# EAGLE design school_shield (EAGLE 9.6.2)
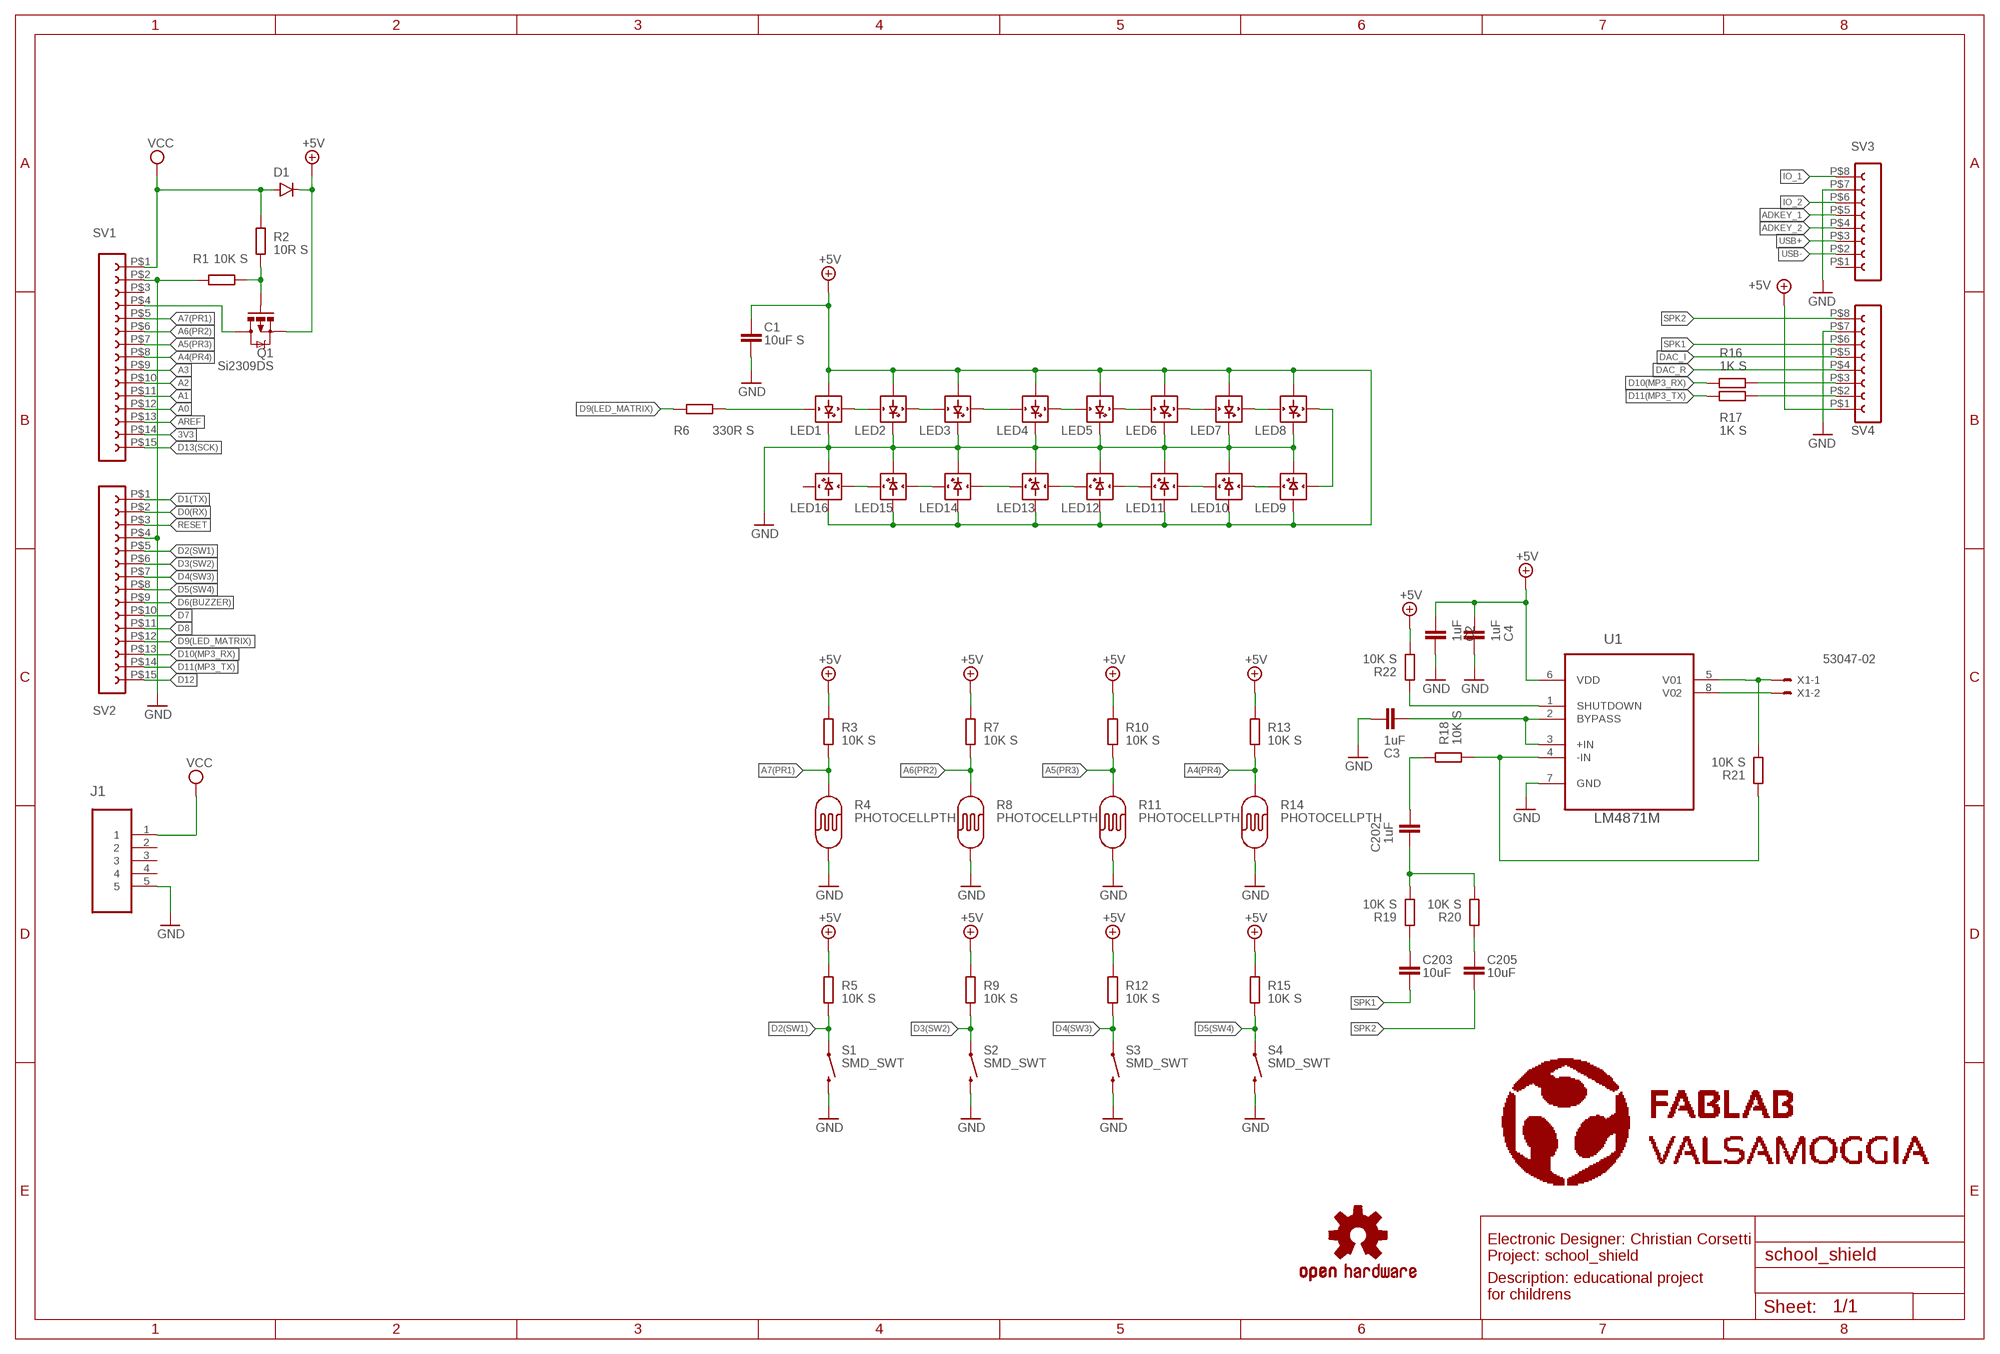
[diagram p0: schematic, sheet 1]

## Parts
C1  10uF S  C-EUC0805  [C0805]
C2  1uF  C-EUC0805  [C0805]
C3  1uF  C-EUC0805  [C0805]
C4  1uF  C-EUC0805  [C0805]
C202  1uF  C-EUC0805  [C0805]
C203  10uF  C-EUC0805  [C0805]
C205  10uF  C-EUC0805  [C0805]
D1  DIODESMA  [SMA-DIODE]
J1  47346-0001  [MOLEX_47346-0001]
LED1  WS2812B_ALT  [WS2812B]
LED2  WS2812B_ALT  [WS2812B]
LED3  WS2812B_ALT  [WS2812B]
LED4  WS2812B_ALT  [WS2812B]
LED5  WS2812B_ALT  [WS2812B]
LED6  WS2812B_ALT  [WS2812B]
LED7  WS2812B_ALT  [WS2812B]
LED8  WS2812B_ALT  [WS2812B]
LED9  WS2812B_ALT  [WS2812B]
LED10  WS2812B_ALT  [WS2812B]
LED11  WS2812B_ALT  [WS2812B]
LED12  WS2812B_ALT  [WS2812B]
LED13  WS2812B_ALT  [WS2812B]
LED14  WS2812B_ALT  [WS2812B]
LED15  WS2812B_ALT  [WS2812B]
LED16  WS2812B_ALT  [WS2812B]
LOGO1  OSHW-LOGOMINI  [OSHW-LOGO-MINI]
Q1  Si2309DS  MOSFET-PCHANNELSMD  [SOT23-3]
R1  10K S  R-EU_R0805  [R0805]
R2  10R S  R-EU_R0805  [R0805]
R3  10K S  R-EU_R0805  [R0805]
R4  PHOTOCELLPTH  [PHOTOCELL]
R5  10K S  R-EU_R0805  [R0805]
R6  330R S  R-EU_R0805  [R0805]
R7  10K S  R-EU_R0805  [R0805]
R8  PHOTOCELLPTH  [PHOTOCELL]
R9  10K S  R-EU_R0805  [R0805]
R10  10K S  R-EU_R0805  [R0805]
R11  PHOTOCELLPTH  [PHOTOCELL]
R12  10K S  R-EU_R0805  [R0805]
R13  10K S  R-EU_R0805  [R0805]
R14  PHOTOCELLPTH  [PHOTOCELL]
R15  10K S  R-EU_R0805  [R0805]
R16  1K S  R-EU_R0805  [R0805]
R17  1K S  R-EU_R0805  [R0805]
R18  10K S  R-EU_R0805  [R0805]
R19  10K S  R-EU_R0805  [R0805]
R20  10K S  R-EU_R0805  [R0805]
R21  10K S  R-EU_R0805  [R0805]
R22  10K S  R-EU_R0805  [R0805]
S1  SMD_SWT  SWITCH-MOMENTARY-2SMD-4  [TACTILE_SWITCH_TALL]
S2  SMD_SWT  SWITCH-MOMENTARY-2SMD-4  [TACTILE_SWITCH_TALL]
S3  SMD_SWT  SWITCH-MOMENTARY-2SMD-4  [TACTILE_SWITCH_TALL]
S4  SMD_SWT  SWITCH-MOMENTARY-2SMD-4  [TACTILE_SWITCH_TALL]
SV1  FE15-1SMD  [FE15_SMD]
SV2  FE15-1SMD  [FE15_SMD]
SV3  FE08-1SMD  [FE08_SMD]
SV4  FE08-1SMD  [FE08_SMD]
U1  LM4871M  [SOIC127P600X175-8N]
U$1  FABLAB  [FABLAB]
X1  53047-02  [53047-02]

## Nets
3V3: SV1.P$14
+5V: C1.2 C2.1 C4.1 D1.C LED1.1-VDD(VDD) LED2.1-VDD(VDD) LED3.1-VDD(VDD) LED4.1-VDD(VDD) LED5.1-VDD(VDD) LED6.1-VDD(VDD) LED7.1-VDD(VDD) LED8.1-VDD(VDD) LED9.1-VDD(VDD) LED10.1-VDD(VDD) LED11.1-VDD(VDD) LED12.1-VDD(VDD) LED13.1-VDD(VDD) LED14.1-VDD(VDD) LED15.1-VDD(VDD) LED16.1-VDD(VDD) Q1.2(S) R3.2 R5.2 R7.2 R9.2 R10.2 R12.2 R13.2 R15.2 R22.1 SV4.P$1 U1.6(VDD)
A0: SV1.P$12
A1: SV1.P$11
A2: SV1.P$10
A3: SV1.P$9
A4(PR4): R13.1 R14.2 SV1.P$8
A5(PR3): R10.1 R11.2 SV1.P$7
A6(PR2): R7.1 R8.2 SV1.P$6
A7(PR1): R3.1 R4.2 SV1.P$5
ADKEY_1: SV3.P$5
ADKEY_2: SV3.P$4
AREF: SV1.P$13
AUDIO: R18.1 R21.2 U1.4(-IN)
D0(RX): SV2.P$2
D1(TX): SV2.P$1
D2(SW1): R5.1 S1.A2 SV2.P$5
D3(SW2): R9.1 S2.A2 SV2.P$6
D4(SW3): R12.1 S3.A2 SV2.P$7
D5(SW4): R15.1 S4.A2 SV2.P$8
D6(BUZZER): SV2.P$9
D7: SV2.P$10
D8: SV2.P$11
D9(LED_MATRIX): R6.2 SV2.P$12
D10(MP3_RX): R16.2 SV2.P$13
D11(MP3_TX): R17.2 SV2.P$14
D12: SV2.P$15
D13(SCK): SV1.P$15
DAC_I: SV4.P$5
DAC_R: SV4.P$4
GND: C1.1 C2.2 C3.2 C4.2 J1.5 LED1.3-GND(GND) LED2.3-GND(GND) LED3.3-GND(GND) LED4.3-GND(GND) LED5.3-GND(GND) LED6.3-GND(GND) LED7.3-GND(GND) LED8.3-GND(GND) LED9.3-GND(GND) LED10.3-GND(GND) LED11.3-GND(GND) LED12.3-GND(GND) LED13.3-GND(GND) LED14.3-GND(GND) LED15.3-GND(GND) LED16.3-GND(GND) R1.2 R4.1 R8.1 R11.1 R14.1 S1.B2 S2.B2 S3.B2 S4.B2 SV1.P$2 SV2.P$4 SV3.P$7 SV4.P$7 U1.7(GND)
IO_1: SV3.P$8
IO_2: SV3.P$6
N$1: Q1.1(G) R1.1 R2.2
N$2: C3.1 U1.2(BYPASS) U1.3(+IN)
N$3: Q1.3(D) SV1.P$4
N$4: LED1.4-DIN(DIN) R6.1
N$6: C205.1 R20.2
N$7: C203.1 R19.2
N$8: C202.1 R19.1 R20.1
N$9: R22.2 U1.1(SHUTDOWN)
N$10: R21.1 U1.5(V01) X1.1
N$11: C202.2 R18.2
N$12: U1.8(V02) X1.2
N$14: LED1.2-DOUT(DOUT) LED2.4-DIN(DIN)
N$15: LED2.2-DOUT(DOUT) LED3.4-DIN(DIN)
N$16: LED3.2-DOUT(DOUT) LED4.4-DIN(DIN)
N$17: LED4.2-DOUT(DOUT) LED5.4-DIN(DIN)
N$18: LED5.2-DOUT(DOUT) LED6.4-DIN(DIN)
N$19: LED6.2-DOUT(DOUT) LED7.4-DIN(DIN)
N$20: LED7.2-DOUT(DOUT) LED8.4-DIN(DIN)
N$21: LED8.2-DOUT(DOUT) LED9.4-DIN(DIN)
N$22: LED9.2-DOUT(DOUT) LED10.4-DIN(DIN)
N$23: LED10.2-DOUT(DOUT) LED11.4-DIN(DIN)
N$24: LED11.2-DOUT(DOUT) LED12.4-DIN(DIN)
N$25: LED12.2-DOUT(DOUT) LED13.4-DIN(DIN)
N$26: LED13.2-DOUT(DOUT) LED14.4-DIN(DIN)
N$27: LED14.2-DOUT(DOUT) LED15.4-DIN(DIN)
N$28: LED15.2-DOUT(DOUT) LED16.4-DIN(DIN)
N$38: R16.1 SV4.P$3
N$39: R17.1 SV4.P$2
RESET: SV2.P$3
SPK1: C203.2 SV4.P$6
SPK2: C205.2 SV4.P$8
USB+: SV3.P$3
USB-: SV3.P$2
VCC: D1.A J1.1 R2.1 SV1.P$1
Unconnected: J1.2 J1.3 J1.4 LED16.2-DOUT(DOUT) SV1.P$3 SV3.P$1

## Notes on the sheet
- Electronic Designer: Christian Corsetti
  Project: school_shield
- Description: educational project
  for childrens

## Library data of the parts
C1 = school_shield:C-EU: CAPACITOR, European symbol
C2-C4 C202 C203 C205 = rcl:C-EU: CAPACITOR, European symbol
D1 = school_shield:DIODE: Diode These are standard reverse protection diodes and small signal diodes. SMA package can handle up to about 1A. SOD-323 can handle about 200mA. What the SOD-323 package when ordering, there are some mfgs out there that are 5-pin packages.
J1 = school_shield:47346-0001: CONN RCPT 5POS MICRO USB R/A SMD; MPN: 47346-0001; OC_FARNELL: 1568026; OC_NEWARK: 47M0505; PACKAGE: 5 POS MICRO USB R/A; SPICEPREFIX: X; SUPPLIER: MOLEX
LED1-LED16 = school_shield:WS2812B_ALT
LOGO1 = school_shield:OSHW-LOGO: Open Source Hardware Logo This logo indicates the piece of hardware it is found on incorporates a OSHW license and/or adheres to the definition of open source hardware found here: http://freedomdefined.org/OSHW
Q1 = school_shield:MOSFET-PCHANNEL: Generic PMOSFET IRLML2244 - TRANS-11153 (SOT-23 -20V -4.3A) (1.Gate 2.Source 3.Drain) FQP27P06 - COM-10349 <http://www.sparkfun.com/products/10349> (TO-220 -60V -27A) (1.Gate 2.Source 3.Drain)
R1-R3 R5-R7 R9 R10 R12 R13 R15-R22 = school_shield:R-EU_: RESISTOR, European symbol
R4 R8 R11 R14 = school_shield:PHOTOCELL: CdS photoresistor. This is a low cost way to detect light levels. Resistance decreases with more incoming light. SparkFun SKU: SEN-09088
S1-S4 = school_shield:SWITCH-MOMENTARY-2: Various NO switches- pushbuttons, reed, etc; PROD_ID: SWCH-11966
SV1 SV2 = school_shield:FE15-1: FEMALE HEADER
SV3 SV4 = school_shield:FE08-1: FEMALE HEADER
U1 = LM4871:LM4871M: Power Amplifier; MPN: LM4871M; OC_FARNELL: 1468873; OC_NEWARK: 41K5780; PACKAGE: SOIC-8; SUPPLIER: NationalSemiconductor
U$1 = school_shield:FABLAB
X1 = school_shield:53?-02: CONNECTOR wire to board 1.25 mm (.049 inch) pitch header

## Net classes
0 signals: width 0.2 mm, drill 0.35 mm, clearance 0.15 mm
1 pwr: width 0.5 mm, drill 40 mm, clearance 0.3 mm

## Board
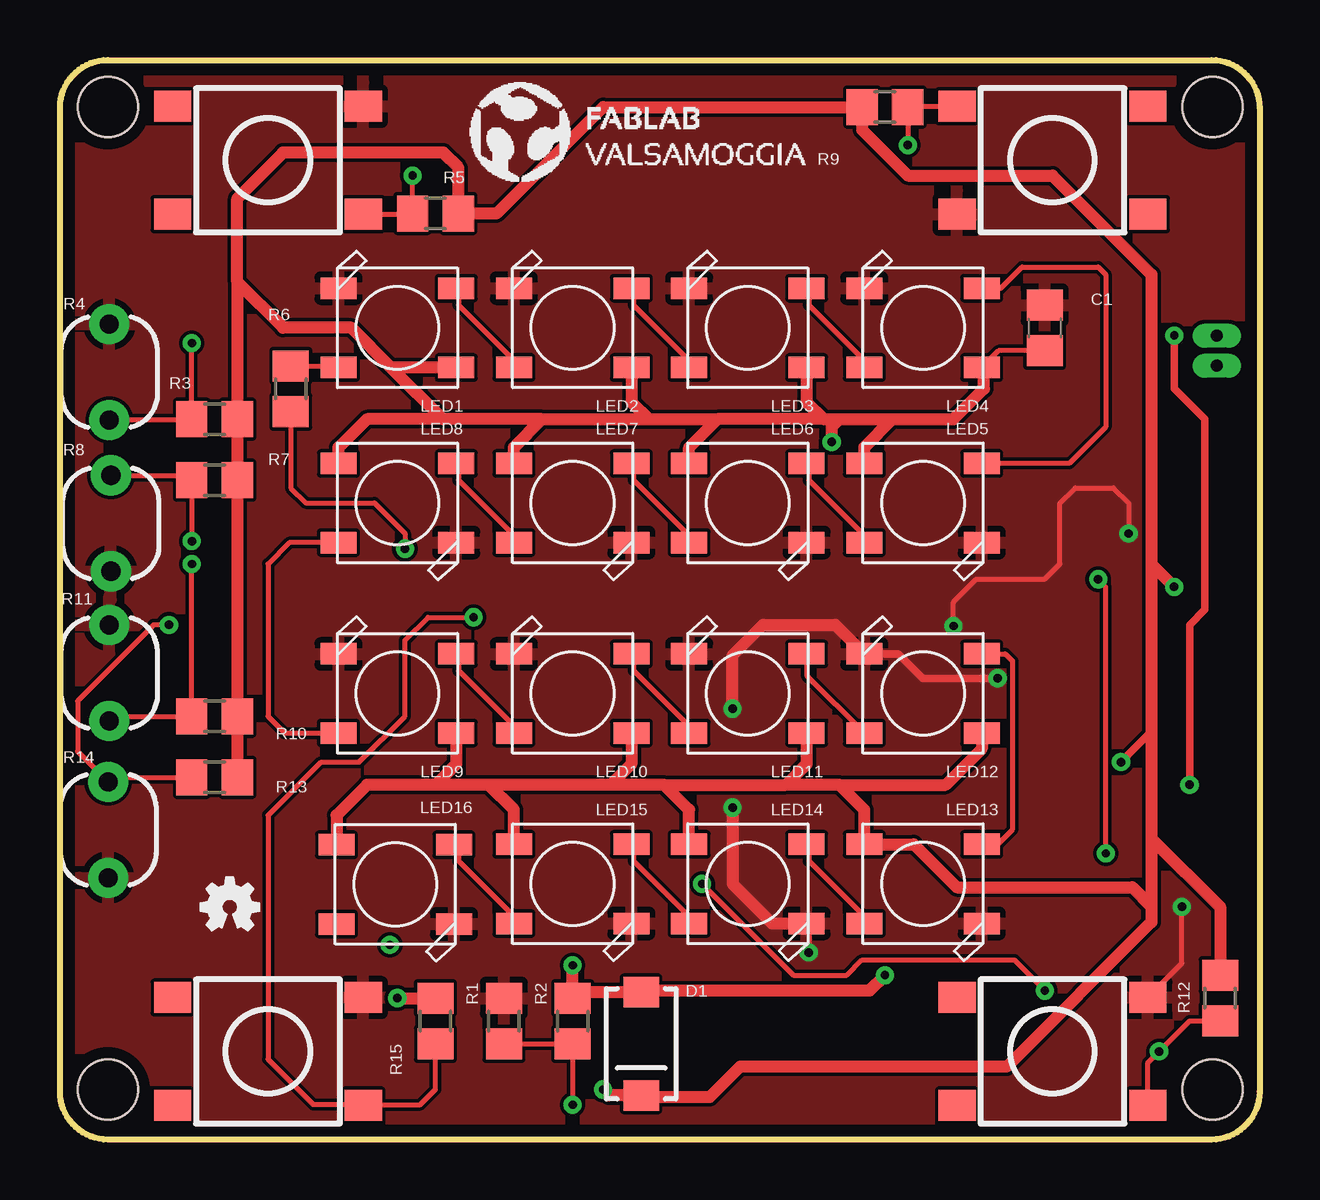
[diagram p1: board, top side]
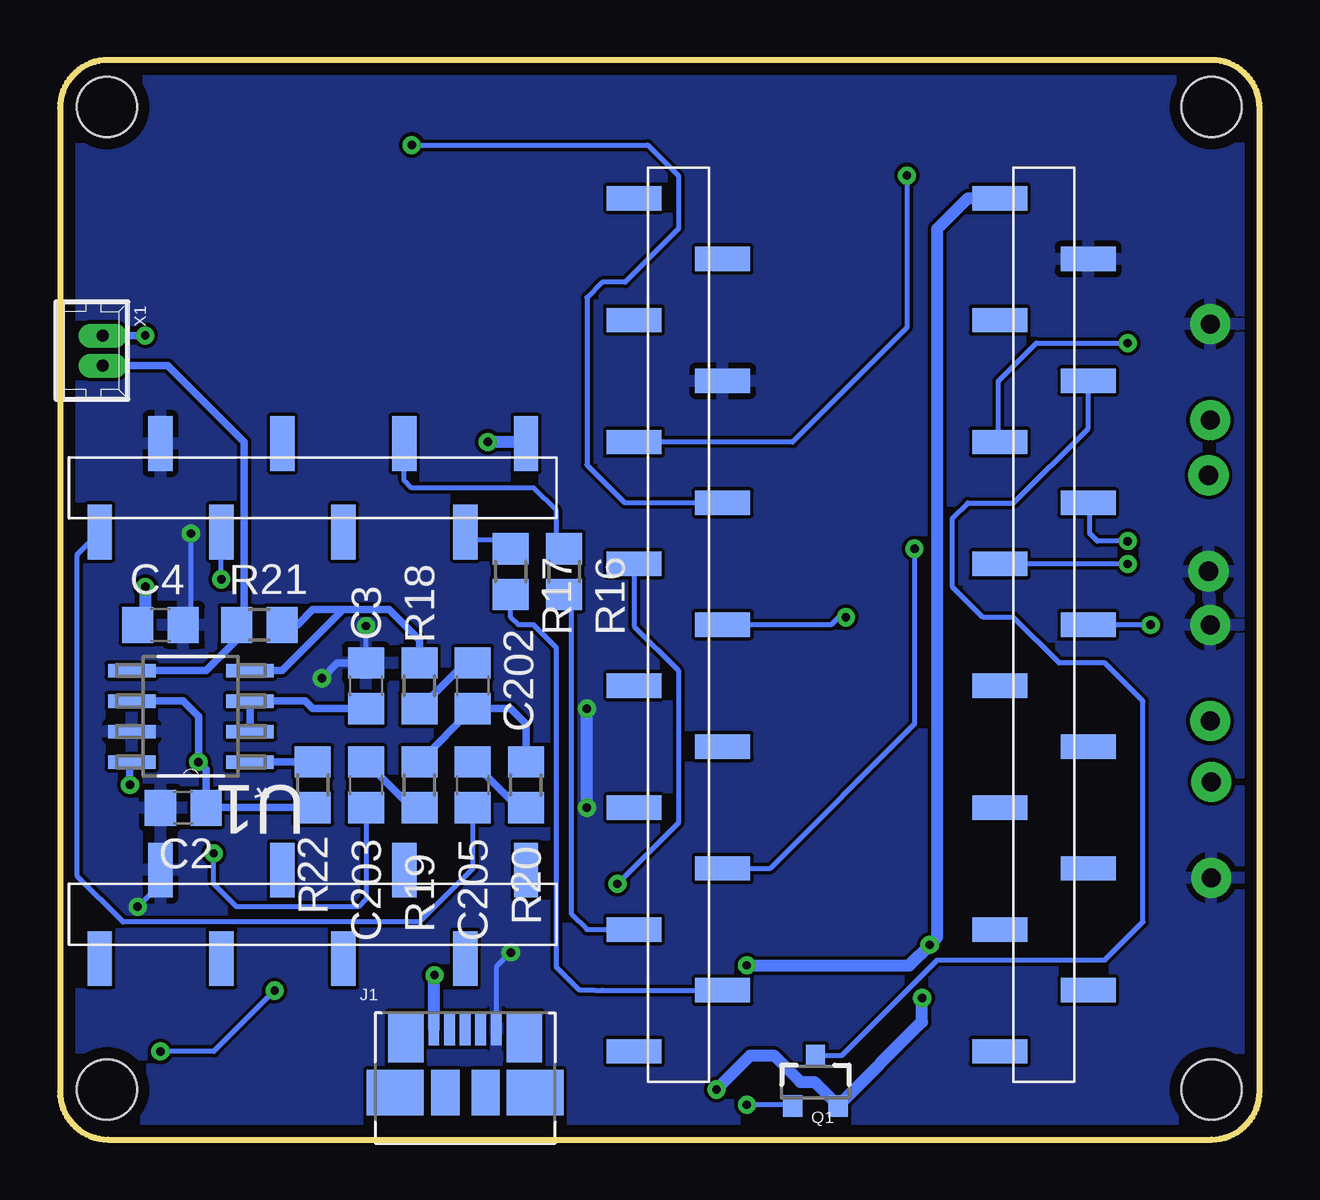
[diagram p2: board, bottom side, seen from below]

Size 50 x 45 mm. Coordinates in mm from the lower left corner, seen from the top.
Outline: 2,0 arc-90 0,2 0,43 arc-90 2,45 48,45 arc-90 50,43 50,2 arc-90 48,0 2,0
Copper layers (1*16): Top 0.035mm / dielectric 1.5mm / Bottom 0.035mm
Design rules "default *": minimum track width 0.15mm, minimum drill 0.35mm, track to track 0.15mm, track to pad 0.15mm, pad to pad 0.15mm, via to via 0.15mm, smd to smd 0.15mm, copper to edge 0.5mm, drill to drill 0.15mm, minimum pad ring 10mil, minimum via ring 8mil, stop-mask expansion 4mil, vias tented up to drill 0mil, thermal gap 10mil
Holes 2.5 mm at 2,43.04 2,2.08 48.04,2.08 48.04,43.04

### Footprints (pad centres in the part's own frame; a part is rotated, then mirrored left to right if it is on the bottom)
C0805 = smd 1.3 x 1.5: 1 -0.95,0; 2 0.95,0
SMA-DIODE = smd 1.27 x 1.47: A -2.15,0; C 2.15,0
MOLEX_47346-0001 = smd 0.45 x 1.38: 1 -1.3,0; 2 -0.65,0; 3 0,0; 4 0.65,0; 5 1.3,0 | smd 1.475 x 2.1: M1 -2.462,-0.36; M2 2.462,-0.36 | smd 2.375 x 1.9: M3 -2.913,-2.66; M6 2.913,-2.66 | smd 1.175 x 1.9: M4 -0.82,-2.66; M5 0.85,-2.66
WS2812B = smd 1.5 x 0.9: 1-VDD 2.45,-1.65; 2-DOUT 2.45,1.65; 3-GND -2.45,1.65; 4-DIN -2.45,-1.65
SOT23-3 = smd 0.8 x 0.9: 1 -0.95,-1; 2 0.95,-1; 3 0,1.1
R0805 = smd 1.3 x 1.5: 1 -0.95,0; 2 0.95,0
PHOTOCELL = drill 0.8 pad 1.676: 1 -2,0; 2 2,0
TACTILE_SWITCH_TALL = smd 1.55 x 1.3: A1 -3.975,-2.25; A2 3.975,-2.25; B1 -3.975,2.25; B2 3.975,2.25
FE15_SMD = smd 1.016 x 2.285: P$1 -17.784,-1.845; P$2 -15.251,1.843; P$3 -12.704,-1.845; P$4 -10.171,1.843; P$5 -7.624,-1.845; P$6 -5.091,1.843; P$7 -2.544,-1.845; P$8 -0.011,1.843; P$9 2.536,-1.845; P$10 5.069,1.843; P$11 7.616,-1.845; P$12 10.149,1.843; P$13 12.696,-1.845; P$14 15.229,1.843; P$15 17.776,-1.845
FE08_SMD = smd 1.016 x 2.285: P$1 -8.894,-1.845; P$2 -6.361,1.843; P$3 -3.814,-1.845; P$4 -1.281,1.843; P$5 1.266,-1.845; P$6 3.799,1.843; P$7 6.346,-1.845; P$8 8.879,1.843
SOIC127P600X175-8N = smd 1.981 x 0.559: 1 -2.464,1.905; 2 -2.464,0.635; 3 -2.464,-0.635; 4 -2.464,-1.905; 5 2.464,-1.905; 6 2.464,-0.635; 7 2.464,0.635; 8 2.464,1.905
53047-02 = drill 0.5 pad 0.698 long: 1 0.625,0.45; 2 -0.625,0.45

### Placement (x,y rotation side)
C1  41.05,33.83 270 top
C2  44.86,13.83 180 bottom
C3  37.24,18.91 90 bottom
C4  45.81,21.45 0 bottom
C202  32.8,18.91 90 bottom
C203  37.24,14.78 270 bottom
C205  32.8,14.78 270 bottom
D1  24.22,3.99 270 top
J1  33.11,4.62 0 bottom
LED1  14.06,33.83 0 top
LED2  21.37,33.83 0 top
LED3  28.67,33.83 0 top
LED4  35.97,33.83 0 top
LED5  35.97,26.53 180 top
LED6  28.67,26.53 180 top
LED7  21.37,26.53 180 top
LED8  14.06,26.53 180 top
LED9  14.06,18.59 0 top
LED10  21.37,18.59 0 top
LED11  28.67,18.59 0 top
LED12  35.97,18.59 0 top
LED13  35.97,10.66 180 top
LED14  28.67,10.66 180 top
LED15  21.37,10.66 180 top
LED16  13.97,10.64 180 top
LOGO1  7.08,9.7 0 top
Q1  18.51,2.4 0 bottom
R1  18.51,4.94 90 top
R2  21.37,4.94 270 top
R3  6.44,30.02 0 top
R4  2.06,31.99 270 top
R5  15.65,38.6 0 top
R6  9.62,31.29 270 top
R7  6.44,27.48 0 top
R8  2.12,25.68 90 top
R9  34.38,43.04 180 top
R10  6.44,17.64 0 top
R11  2.06,19.45 270 top
R12  48.35,5.89 90 top
R13  6.44,15.1 0 top
R14  2.01,12.91 90 top
R15  15.65,4.94 90 top
R16  28.99,23.67 270 bottom
R17  31.21,23.67 270 bottom
R18  35.02,18.91 270 bottom
R19  35.02,14.78 270 bottom
R20  30.57,14.78 270 bottom
R21  41.69,21.45 0 bottom
R22  39.46,14.78 90 bottom
S1  8.67,40.82 0 top
S2  41.37,40.82 180 top
S3  41.37,3.67 0 top
S4  8.67,3.67 0 top
SV1  8.98,21.45 270 bottom
SV2  24.22,21.45 270 bottom
SV3  39.46,9.39 180 bottom
SV4  39.46,27.17 180 bottom
U1  44.54,17.64 180 bottom
U$1  16.6,39.55 0 top
X1  48.67,32.88 270 bottom

### Tracks (layer width: path | path; a pad name or v marks a point on that pad's centre or on a via)
+5V  (via drill 0.35)
  Top 0.2: C1.2 39.12,32.88 38.5,32.26 LED4.1-VDD
  Top 0.305: v44.23,15.74 45.5,17.01 45.5,17.64
  Top 0.5: LED8.1-VDD 11.61,28.84 12.79,30.02 15.97,30.02 | 31.84,30.02 27.4,30.02 | 31.84,30.02 32.48,30.02 | 32.48,30.02 34.7,30.02 | 24.54,30.02 27.4,30.02 | 20.1,30.02 15.97,30.02 | 20.1,30.02 24.54,30.02 | 34.7,30.02 37.24,30.02 38.51,31.29 38.51,32.25 38.5,32.26 | LED5.1-VDD 33.52,28.84 34.7,30.02 | LED6.1-VDD 26.22,28.84 27.4,30.02 | LED2.1-VDD 23.82,30.75 24.54,30.02 | LED3.1-VDD 31.12,30.75 31.84,30.02 | LED7.1-VDD 18.92,28.84 20.1,30.02 | 7.39,35.74 7.39,39.23 9.3,41.14 15.97,41.14 16.6,40.5 R5.2 18.19,38.6 22.64,43.04 R9.2 33.43,42.09 35.34,40.18 41.37,40.18 45.5,36.06 45.5,23.99 | 7.39,35.74 R3.2 R7.2 R10.2 R13.2 | 13.81,32.18 15.97,30.02 | 13.81,32.18 12.16,33.83 9.3,33.83 7.39,35.74 | LED1.1-VDD 13.81,32.18 | 45.5,12.56 48.35,9.7 R12.2 | 45.5,12.56 45.5,9.7 | 45.5,9.7 45.5,9.07 39.46,3.04 28.35,3.04 27.08,1.77 24.3,1.77 D1.C 22.88,1.84 v22.64,2.08 | v14.06,5.89 v14.07,5.89 R15.2 | 45.5,23.99 45.5,17.64 45.5,12.56 | 45.5,23.99 v46.45,23.04 v46.44,23.03 | LED12.1-VDD 38.42,16.28 36.92,14.78 32.48,14.78 | 17.87,14.78 15.65,14.78 | 25.18,14.78 22.95,14.78 | 25.18,14.78 30.26,14.78 | 22.95,14.78 17.87,14.78 | 32.48,14.78 30.26,14.78 | 15.65,14.78 12.79,14.78 11.52,13.51 LED16.1-VDD | LED9.1-VDD 16.51,15.65 15.65,14.78 | LED11.1-VDD 31.12,15.65 30.26,14.78 | LED15.1-VDD 18.92,13.74 17.87,14.78 | 32.48,14.78 33.52,13.74 LED13.1-VDD 35.59,12.31 37.39,10.51 44.69,10.51 45.5,9.7 | LED10.1-VDD 23.82,15.65 22.95,14.78 | LED14.1-VDD 26.22,13.74 25.18,14.78 | v32.17,29.08 32.17,29.71 32.48,30.02
  Bottom 0.305: R22.1 C2.1 43.91,15.42 v44.23,15.74 44.23,17.64 44.86,18.28 U1.6
  Bottom 0.5: v22.64,2.08 21.22,3.5 20.24,3.5 19.14,2.4 18.56,2.4 Q1.2 14.06,4.9 v14.06,5.89 | v46.44,23.03 46.44,21.77 C4.1 | SV4.P$1 30.63,29.07 v32.16,29.07 v32.17,29.08
A4(PR4)  (via drill 0.35)
  Top 0.2: R13.1 2.2,15.1 R14.2 0.73,16.19 0.73,18.28 3.9,21.45 v4.54,21.45
  Bottom 0.2: v4.54,21.45 SV1.P$8
A5(PR3)  (via drill 0.35)
  Top 0.2: R11.2 2.25,17.64 R10.1 v5.49,23.99
  Bottom 0.2: v5.49,23.99 SV1.P$7
A6(PR2)  (via drill 0.35)
  Top 0.2: R8.2 5.29,27.68 R7.1 v5.49,24.95 v5.49,24.94
  Bottom 0.2: v5.49,24.94 6.76,24.94 7.08,25.26 7.08,26.48 SV1.P$6
A7(PR1)  (via drill 0.35)
  Top 0.2: R4.2 5.46,29.99 R3.1 v5.49,33.2
  Bottom 0.2: SV1.P$5 10.89,29.14 10.89,31.61 9.3,33.2 v5.49,33.2
AUDIO
  Bottom 0.305: R18.1 35.02,20.82 36.29,22.09 38.19,22.09 | R21.2 40.1,21.45 39.46,22.09 38.19,22.09 | U1.4 40.73,19.55 38.19,22.09
D2(SW1)  (via drill 0.35)
  Top 0.2: S1.A2 14.67,38.57 R5.1 v14.7,40.18
  Bottom 0.2: v14.7,40.18 14.7,33.83 19.46,29.07 SV2.P$5
D3(SW2)  (via drill 0.35)
  Top 0.2: S2.A2 35.36,43.07 R9.1 v35.33,41.46 v35.34,41.45
  Bottom 0.2: SV2.P$6 26.46,26.54 28.03,28.12 28.03,35.1 27.4,35.74 26.45,35.74 24.22,37.96 24.22,40.18 25.49,41.45 v35.34,41.45
D4(SW3)  (via drill 0.35)
  Top 0.2: R12.1 47.08,4.94 v45.81,3.67 45.34,3.2 S3.A2 | v41.05,6.21 39.78,7.48 33.43,7.48 32.8,6.85 30.57,6.85 v26.76,10.66
  Bottom 0.2: SV2.P$7 26.07,21.39 24.22,19.55 24.22,13.2 v26.76,10.66 | v41.05,6.21 43.59,3.67 v45.81,3.67
D5(SW4)  (via drill 0.35)
  Top 0.2: v17.24,21.77 15.33,21.77 14.38,20.82 14.38,17.64 12.48,15.74 10.89,15.74 8.67,13.51 8.67,3.35 10.57,1.45 12.48,1.45 12.5,1.42 S4.A2 12.67,1.45 15.02,1.45 15.65,2.08 R15.1
  Bottom 0.2: v17.24,21.77 17.56,21.77 17.87,21.45 SV2.P$8
D9(LED_MATRIX)  (via drill 0.35)
  Top 0.2: v14.38,24.63 14.38,25.26 13.11,26.53 10.25,26.53 9.62,27.17 R6.2
  Bottom 0.2: v14.38,24.63 14.38,17.32 20.41,11.29 SV2.P$12
D10(MP3_RX)
  Bottom 0.2: SV2.P$13 28.04,8.76 28.67,9.39 28.67,22.41 R16.2
D11(MP3_TX)
  Bottom 0.2: SV2.P$14 27.4,6.22 27.73,6.22 28.34,6.22 29.3,7.19 29.3,20.5 30.26,21.45 30.89,21.45 31.21,21.77 R17.2
GND  (via drill 0.35)
  Top 0.2: LED14.3-GND 31.21,8.92 v31.21,7.8 | S3.B2 46.77,7.34 v46.77,9.7 | v37.24,21.41 37.24,22.4 38.19,23.36 41.05,23.36 41.69,23.99 41.69,26.53 42.32,27.17 43.91,27.17 44.54,26.53 v44.54,25.26
  Top 0.305: LED12.3-GND 34.96,20.24 35.97,19.23 v39.08,19.23
  Top 0.5: LED12.3-GND 32.31,21.45 29.3,21.45 28.03,20.18 v28.03,17.96 | LED14.3-GND 29.68,9.01 28.03,10.66 v28.03,13.83
  Bottom 0.2: v31.21,7.8 31.81,7.19 J1.5 | v46.77,9.7 45.81,10.66 SV3.P$7 | C3.2 v37.24,21.41 | v44.54,25.26 44.54,21.77 C4.2
  Bottom 0.305: v39.08,19.23 38.45,19.86 C3.2
  Bottom 0.5: v28.03,13.83 v28.03,17.96
  pour Top: 1.36,44.95 49.94,44.95 49.94,0.18 -0.22,0.18 -0.22,44.95
  pour Bottom: 1.05,45.26 50.26,45.26 50.26,-0.14 -0.22,-0.14 -0.22,45.26
N$1  (via drill 0.35)
  Top 0.2: R1.1 R2.2 v21.37,1.45
  Bottom 0.2: Q1.1 19.51,1.45 v21.37,1.45
N$2
  Bottom 0.305: U1.2 U1.3 39.78,18.28 39.47,17.96 C3.1
N$3
  Bottom 0.2: SV1.P$4 7.14,29.64 10.25,26.53 12.16,26.53 12.79,25.9 12.79,23.04 11.52,21.77 10.25,21.77 8.35,19.86 6.44,19.86 4.86,18.28 4.86,9.07 6.44,7.48 13.43,7.48 17.41,3.5 Q1.3
N$4
  Top 0.2: R6.1 11.55,32.24 LED1.4-DIN
N$6
  Bottom 0.305: C205.1 30.9,13.83 R20.2
N$7
  Bottom 0.305: C203.1 35.34,13.83 R19.2
N$8
  Bottom 0.305: R20.1 30.57,17.32 31.21,17.96 C202.1 R19.1
N$9
  Bottom 0.305: U1.1 R22.2
N$10
  Bottom 0.305: U1.5 43.91,19.55 42.64,20.82 R21.1 42.64,21.77 42.32,22.09 42.32,29.07 45.51,32.26 X1.1
N$11
  Bottom 0.305: R18.2 33.12,19.86 C202.2
N$12  (via drill 0.35)
  Top 0.305: v47.08,14.78 47.08,21.45 47.72,22.09 47.72,30.02 46.45,31.29 v46.45,33.52
  Bottom 0.305: U1.8 47.08,15.66 v47.08,14.78 | v46.45,33.52 48.21,33.52 X1.2
N$14
  Top 0.2: LED1.2-DOUT 16.6,35.39 16.6,34.79 18.92,32.47 LED2.4-DIN
N$15
  Top 0.2: LED2.2-DOUT 23.91,35.39 23.91,34.79 26.22,32.47 LED3.4-DIN
N$16
  Top 0.2: LED3.2-DOUT 31.21,35.39 31.21,34.79 33.52,32.47 LED4.4-DIN
N$17
  Top 0.2: LED5.4-DIN 42.07,28.18 43.59,29.71 43.59,36.06 43.27,36.37 40.1,36.37 39.21,35.48 LED4.2-DOUT
N$18
  Top 0.2: LED6.4-DIN 31.21,28.09 31.21,27.48 33.52,25.17 LED5.2-DOUT
N$19
  Top 0.2: LED7.4-DIN 23.91,28.09 23.91,27.48 26.22,25.17 LED6.2-DOUT
N$20
  Top 0.2: LED8.4-DIN 16.6,28.09 16.6,27.48 18.92,25.17 LED7.2-DOUT
N$21
  Top 0.2: LED8.2-DOUT 9.56,24.88 8.67,23.99 8.67,17.64 9.36,16.94 LED9.4-DIN
N$22
  Top 0.2: LED9.2-DOUT 16.6,20.15 16.6,19.55 18.92,17.23 LED10.4-DIN
N$23
  Top 0.2: LED10.2-DOUT 23.91,20.15 23.91,19.55 26.22,17.23 LED11.4-DIN
N$24
  Top 0.2: LED11.2-DOUT 31.12,19.35 LED12.4-DIN
N$25
  Top 0.2: LED12.2-DOUT 39.4,20.24 39.71,19.94 39.71,12.93 39.09,12.31 LED13.4-DIN
N$26
  Top 0.2: LED14.4-DIN 31.21,12.22 31.21,11.61 33.52,9.3 LED13.2-DOUT
N$27
  Top 0.2: 23.91,12.22 LED15.4-DIN 23.91,12.22 | 23.91,12.22 23.91,11.61 26.22,9.3 LED14.2-DOUT
N$28
  Top 0.2: LED16.4-DIN 16.6,12.1 16.6,11.61 18.92,9.3 LED15.2-DOUT
N$38
  Bottom 0.2: R16.1 29.3,24.94 29.3,26.21 30.26,27.17 35.34,27.17 35.65,27.48 SV4.P$3
N$39
  Bottom 0.2: SV4.P$2 32.76,24.98 31.57,24.98 R17.1
SPK1  (via drill 0.35)
  Top 0.2: v43.59,11.93 43.59,23.04 v43.27,23.36
  Bottom 0.2: C203.2 37.24,10.02 37.56,9.7 42.64,9.7 43.59,10.66 v43.59,11.93 | v43.27,23.36 43.27,25.31 SV4.P$6
SPK2
  Bottom 0.2: C205.2 32.8,11.29 35.02,9.07 47.37,9.07 49.27,10.97 49.27,24.39 SV4.P$8
VCC  (via drill 0.35)
  Top 0.2: D1.A 24.3,6.21 | 21.61,6.14 R2.1
  Top 0.5: D1.A 21.61,6.14 | R2.1 v21.37,7.26 | v34.38,6.85 33.75,6.21 24.3,6.21
  Bottom 0.2: 34.41,6.82 v34.38,6.85
  Bottom 0.5: J1.1 34.41,6.82 | SV1.P$1 12.16,39.24 13.43,37.96 13.43,8.43 v13.75,8.12 14.6,7.26 v21.37,7.26